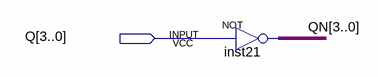
[diagram p0: schematic sheet]
// Quartus schematic BUS5.bdf as structural Verilog: 1 symbols, 1 pins
module BUS5 (
  input  [3:0] Q
);

  wire [3:0] QN;

  assign QN = ~Q;  // NOT inst21, 4 bits wide
endmodule
